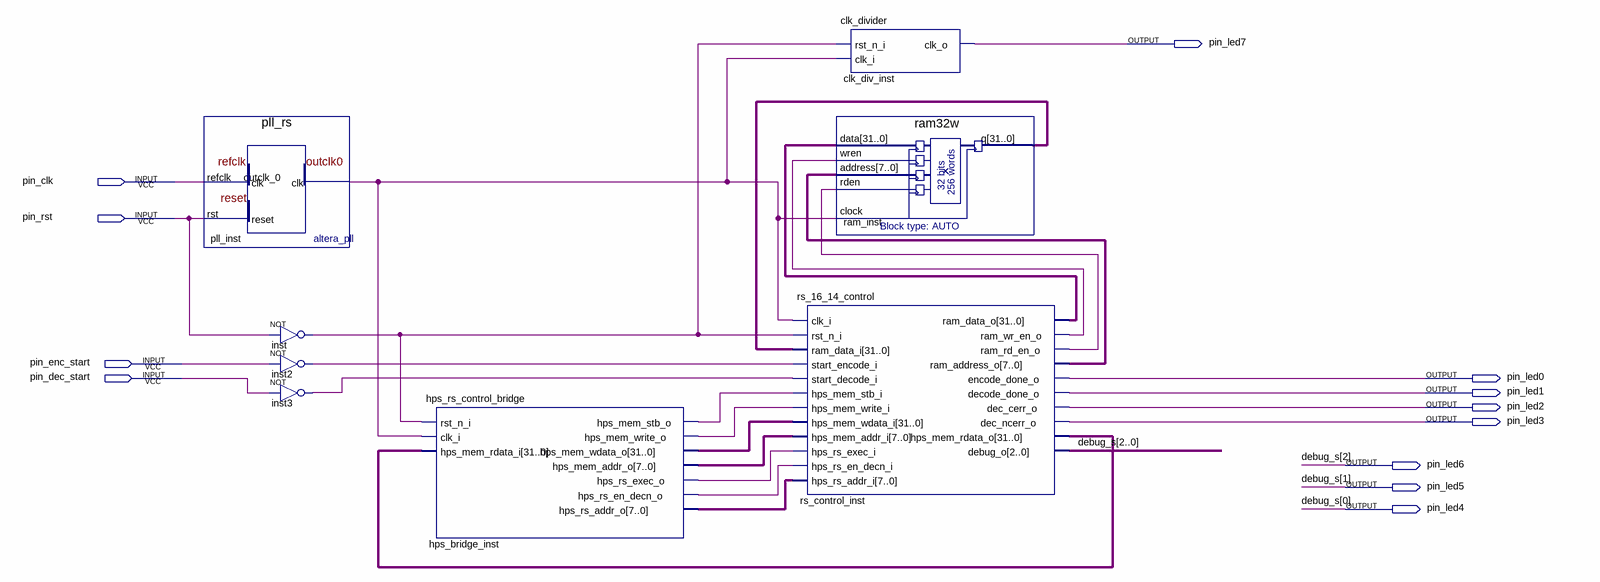
[diagram p0: schematic sheet]
// Quartus schematic reed_solomon_top.bdf as structural Verilog: 8 symbols, 12 pins
module reed_solomon_top (
  input  pin_clk,
  input  pin_rst,
  input  pin_enc_start,
  input  pin_dec_start,
  output pin_led7,
  output pin_led0,
  output pin_led1,
  output pin_led2,
  output pin_led3,
  output pin_led6,
  output pin_led5,
  output pin_led4
);

  wire hps_bridge_inst_hps_mem_stb_o, hps_bridge_inst_hps_mem_write_o, hps_bridge_inst_hps_rs_en_decn_o,
       hps_bridge_inst_hps_rs_exec_o, inst2_out, inst3_out, inst_out, pll_inst_outclk_0,
       rs_control_inst_ram_rd_en_o, rs_control_inst_ram_wr_en_o;
  wire [7:0] hps_bridge_inst_hps_mem_addr_o, hps_bridge_inst_hps_rs_addr_o, rs_control_inst_ram_address_o;
  wire [31:0] hps_bridge_inst_hps_mem_wdata_o, ram_inst_q, rs_control_inst_hps_mem_rdata_o,
       rs_control_inst_ram_data_o;

  pll_rs pll_inst (.refclk(pin_clk), .rst(pin_rst), .outclk_0(pll_inst_outclk_0));
  not inst (inst_out, pin_rst);
  not inst2 (inst2_out, pin_enc_start);
  not inst3 (inst3_out, pin_dec_start);
  hps_rs_control_bridge hps_bridge_inst (
    .rst_n_i(inst_out), .clk_i(pll_inst_outclk_0), .hps_mem_rdata_i(rs_control_inst_hps_mem_rdata_o),
    .hps_mem_stb_o(hps_bridge_inst_hps_mem_stb_o), .hps_mem_write_o(hps_bridge_inst_hps_mem_write_o),
    .hps_mem_wdata_o(hps_bridge_inst_hps_mem_wdata_o), .hps_mem_addr_o(hps_bridge_inst_hps_mem_addr_o),
    .hps_rs_exec_o(hps_bridge_inst_hps_rs_exec_o), .hps_rs_en_decn_o(hps_bridge_inst_hps_rs_en_decn_o),
    .hps_rs_addr_o(hps_bridge_inst_hps_rs_addr_o));
  rs_16_14_control rs_control_inst (
    .clk_i(pll_inst_outclk_0), .rst_n_i(inst_out), .ram_data_i(ram_inst_q), .start_encode_i(inst2_out),
    .start_decode_i(inst3_out), .hps_mem_stb_i(hps_bridge_inst_hps_mem_stb_o),
    .hps_mem_write_i(hps_bridge_inst_hps_mem_write_o), .hps_mem_wdata_i(hps_bridge_inst_hps_mem_wdata_o),
    .hps_mem_addr_i(hps_bridge_inst_hps_mem_addr_o), .hps_rs_exec_i(hps_bridge_inst_hps_rs_exec_o),
    .hps_rs_en_decn_i(hps_bridge_inst_hps_rs_en_decn_o), .hps_rs_addr_i(hps_bridge_inst_hps_rs_addr_o),
    .ram_data_o(rs_control_inst_ram_data_o), .ram_wr_en_o(rs_control_inst_ram_wr_en_o),
    .ram_rd_en_o(rs_control_inst_ram_rd_en_o), .ram_address_o(rs_control_inst_ram_address_o),
    .encode_done_o(pin_led0), .decode_done_o(pin_led1), .dec_cerr_o(pin_led2), .dec_ncerr_o(pin_led3),
    .hps_mem_rdata_o(rs_control_inst_hps_mem_rdata_o), .debug_o({pin_led6, pin_led5, pin_led4}));
  clk_divider clk_div_inst (.rst_n_i(inst_out), .clk_i(pll_inst_outclk_0), .clk_o(pin_led7));
  ram32w ram_inst (
    .data(rs_control_inst_ram_data_o), .wren(rs_control_inst_ram_wr_en_o),
    .address(rs_control_inst_ram_address_o), .rden(rs_control_inst_ram_rd_en_o), .clock(pll_inst_outclk_0),
    .q(ram_inst_q));

  // Other names for the same wires on the sheet: debug_s[2:0] = {pin_led6, pin_led5, pin_led4}
endmodule
